# EAGLE board EEZ PSU Arduino shield+BP r3B4 (EAGLE 6.1), part 1 of 2
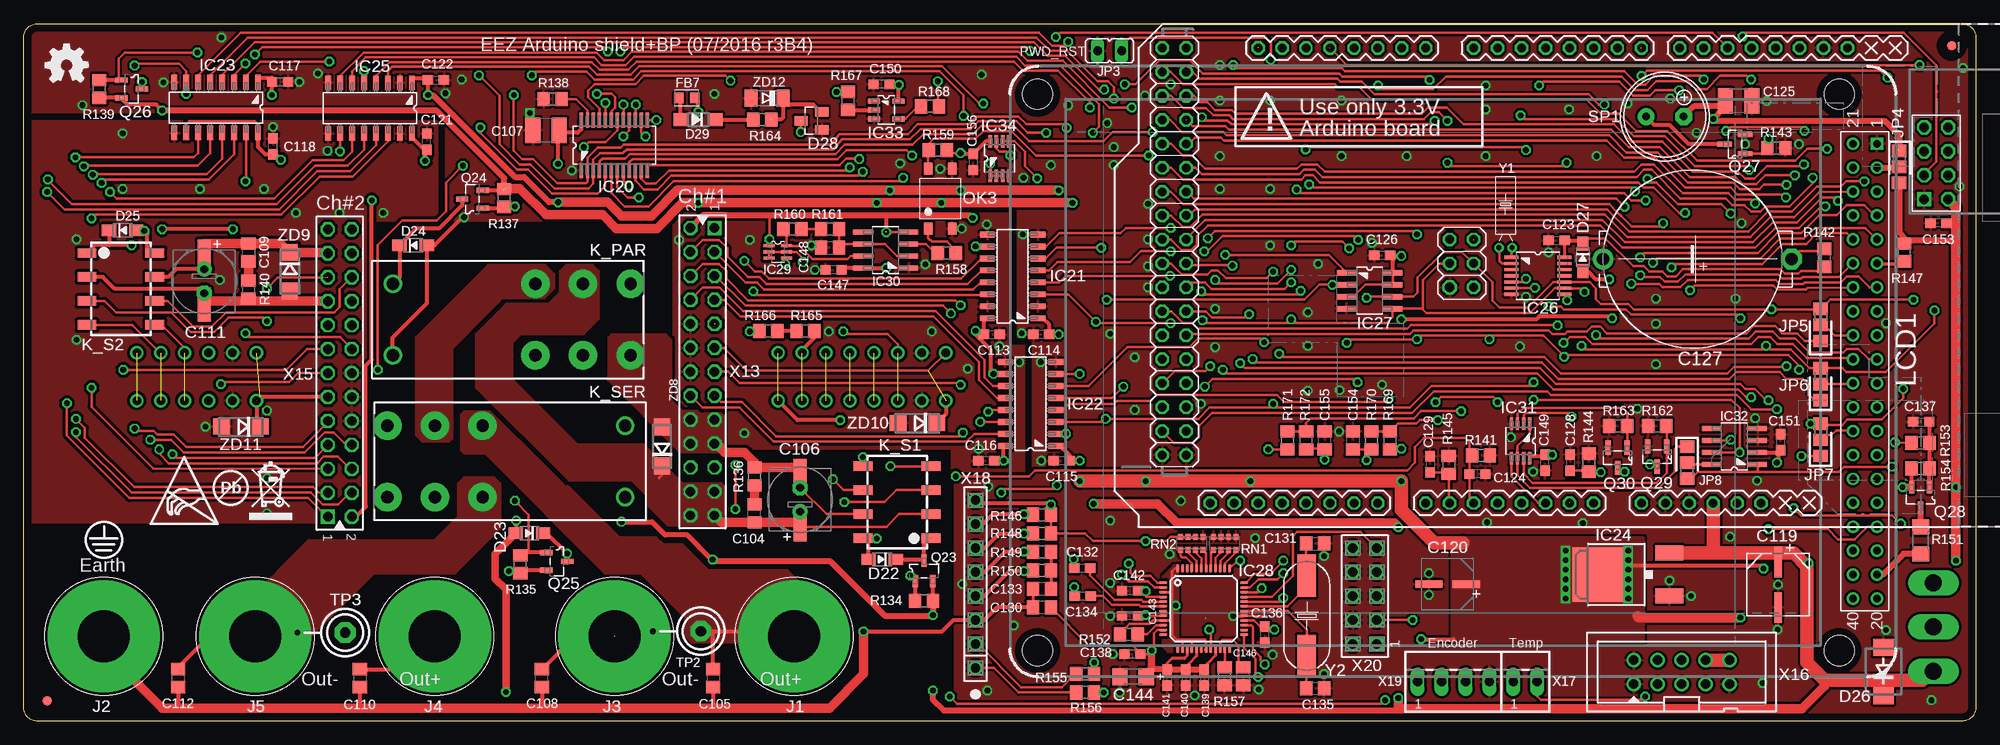
[diagram p5: board, top side]
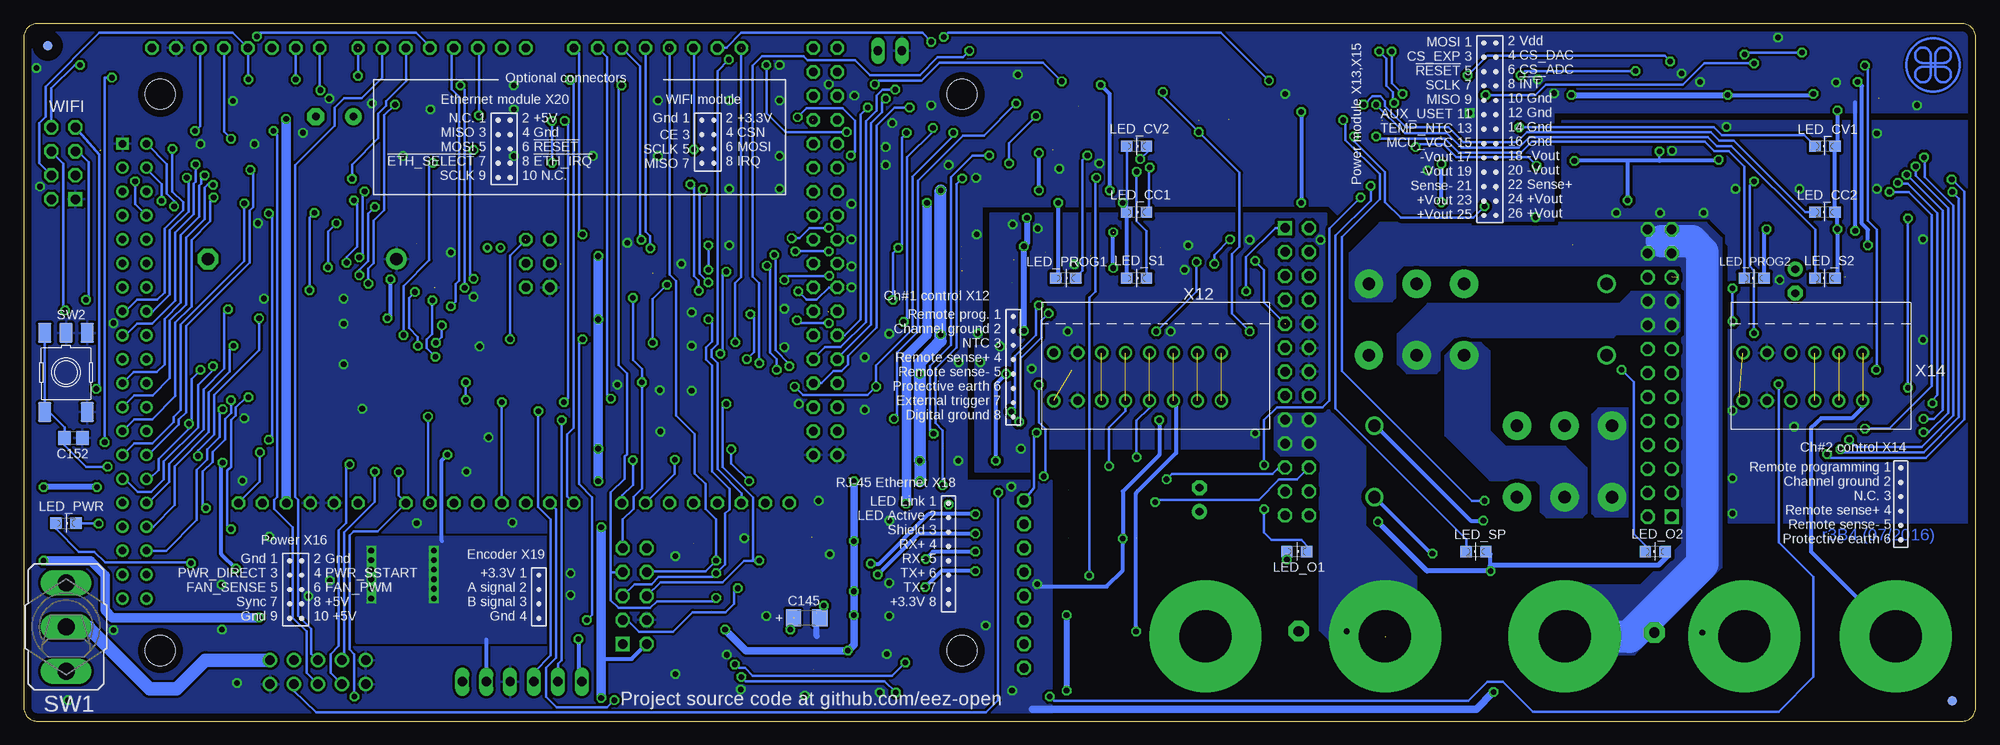
[diagram p6: board, bottom side, seen from below]

Size 207 x 74 mm. Coordinates in mm from the lower left corner, seen from the top.
Outline: 1.5,74 205.5,74 arc-90 207,72.5 207,1.5 arc-90 205.5,0 1.5,0 arc-90 0,1.5 0,72.5 arc-90 1.5,74
Copper layers (1+5*16): Top 0.035mm / dielectric 0.75mm / Route5 0.035mm / dielectric 0.75mm / Bottom 0.035mm
Design rules: minimum track width 10mil, minimum drill 0.5mm, track to track 8mil, track to pad 8mil, pad to pad 8mil, via to via 8mil, smd to smd 8mil, copper to edge 30mil, drill to drill 8mil, minimum pad ring 10mil, minimum via ring 8mil, stop-mask expansion 4mil, vias tented up to drill 25mil, thermal gap 10mil
Net classes: 0 default: width 0.254 mm, drill 0.584 mm, clearance 0.254 mm; 1 dgnd: width 0.254 mm, drill 0.584 mm, clearance 0.254 mm; 2 gnd: width 0.254 mm, drill 0.584 mm, clearance 0.254 mm

## Footprints (pad centres in the part's own frame; a part is rotated, then mirrored left to right if it is on the bottom)
C0805 = smd 1.3 x 1.5: 1 -0.95,0; 2 0.95,0
CAPAE660X610N_COMBO2 = smd 3.6 x 1.4: 1 -2.6,0; 2 2.5,0 | drill 0.813 pad 1.6: 1.1 -1.27,0 | drill 0.813 pad 1.6 octagon: 2.1 1.27,0
C1210 = smd 1.6 x 2.7: 1 -1.4,0; 2 1.4,0
C0603 = smd 1.1 x 1: 1 -0.85,0; 2 0.85,0
CAPAE660X610N = smd 3.251 x 0.762: 1 -2.413,0; 2 2.413,0
PANASONIC_C = smd 2.87 x 0.762: 1 -1.981,0; 2 1.981,0
SG-R20MM = drill 1.3 pad 2.184 octagon: 1 10.389,0 | drill 1.3 pad 2.184: 2 -9.601,0
EC1206 = smd 1.6 x 1.8: + -1.4,0; - 1.4,0
SOD323-W = smd 1.5 x 1.2: A 1.45,0; C -1.45,0
DO214AA = smd 1.8 x 2.2: A 2.55,0; C -2.55,0
SOT23 = smd 1 x 1.4: 1 -0.95,-1.1; 2 0.95,-1.1; 3 0,1.1
SOD123 = smd 1.4 x 1.4: A 1.9,0; C -1.9,0
BEAD0603 = smd 1 x 1.1: P$1 -0.85,0; P$2 0.85,0
FIDUCIAL_DUAL = smd 1.016 x 1.016 bottom: B 0,0 | smd 1.016 x 1.016: T 0,0
SOP63P600X175-24N = smd 1.6 x 0.356: 1 -2.667,3.505; 2 -2.667,2.845; 3 -2.667,2.235; 4 -2.667,1.575; 5 -2.667,0.965; 6 -2.667,0.305; 7 -2.667,-0.305; 8 -2.667,-0.965; 9 -2.667,-1.575; 10 -2.667,-2.235; 11 -2.667,-2.845; 12 -2.667,-3.505; 13 2.667,-3.505; 14 2.667,-2.845; 15 2.667,-2.235; 16 2.667,-1.575; 17 2.667,-0.965; 18 2.667,-0.305; 19 2.667,0.305; 20 2.667,0.965; 21 2.667,1.575; 22 2.667,2.235; 23 2.667,2.845; 24 2.667,3.505
SOIC-16 = smd 1.549 x 0.61: 1 -2.692,4.445; 2 -2.692,3.175; 3 -2.692,1.905; 4 -2.692,0.635; 5 -2.692,-0.635; 6 -2.692,-1.905; 7 -2.692,-3.175; 8 -2.692,-4.445; 9 2.692,-4.445; 10 2.692,-3.175; 11 2.692,-1.905; 12 2.692,-0.635; 13 2.692,0.635; 14 2.692,1.905; 15 2.692,3.175; 16 2.692,4.445
DPACK = smd 1.6 x 3: 1 -2.28,-4.8; 3 2.28,-4.8 | smd 5.8 x 6.2: 4 0,2.38
SOP65P640X120-14N = smd 1.473 x 0.356: 1 -2.819,1.956; 2 -2.819,1.295; 3 -2.819,0.66; 4 -2.819,0; 5 -2.819,-0.66; 6 -2.819,-1.295; 7 -2.819,-1.956; 8 2.819,-1.956; 9 2.819,-1.295; 10 2.819,-0.66; 11 2.819,0; 12 2.819,0.66; 13 2.819,1.295; 14 2.819,1.956
SOIC127P600X175-8N = smd 1.981 x 0.559: 1 -2.464,1.905; 2 -2.464,0.635; 3 -2.464,-0.635; 4 -2.464,-1.905; 5 2.464,-1.905; 6 2.464,-0.635; 7 2.464,0.635; 8 2.464,1.905
TQFP48-7X7 = smd 0.85 x 0.32: 1 -4.275,2.75; 2 -4.275,2.25; 3 -4.275,1.75; 4 -4.275,1.25; 5 -4.275,0.75; 6 -4.275,0.25; 7 -4.275,-0.25; 8 -4.275,-0.75; 9 -4.275,-1.25; 10 -4.275,-1.75; 11 -4.275,-2.25; 12 -4.275,-2.75; 25 4.275,-2.75; 26 4.275,-2.25; 27 4.275,-1.75; 28 4.275,-1.25; 29 4.275,-0.75; 30 4.275,-0.25; 31 4.275,0.25; 32 4.275,0.75; 33 4.275,1.25; 34 4.275,1.75; 35 4.275,2.25; 36 4.275,2.75 | smd 0.32 x 0.85: 13 -2.75,-4.275; 14 -2.25,-4.275; 15 -1.75,-4.275; 16 -1.25,-4.275; 17 -0.75,-4.275; 18 -0.25,-4.275; 19 0.25,-4.275; 20 0.75,-4.275; 21 1.25,-4.275; 22 1.75,-4.275; 23 2.25,-4.275; 24 2.75,-4.275; 37 2.75,4.275; 38 2.25,4.275; 39 1.75,4.275; 40 1.25,4.275; 41 0.75,4.275; 42 0.25,4.275; 43 -0.25,4.275; 44 -0.75,4.275; 45 -1.25,4.275; 46 -1.75,4.275; 47 -2.25,4.275; 48 -2.75,4.275
SOT65P210X110-6N = smd 1.168 x 0.356: 1 -0.94,0.66; 2 -0.94,0; 3 -0.94,-0.66; 4 0.94,-0.66; 5 0.94,0; 6 0.94,0.66
SOP65P400X130-8N = smd 1.321 x 0.356: 1 -1.829,0.965; 2 -1.829,0.33; 3 -1.829,-0.33; 4 -1.829,-0.965; 5 1.829,-0.965; 6 1.829,-0.33; 7 1.829,0.33; 8 1.829,0.965
SOT95P280X145-5N = smd 1.27 x 0.559: 1 -1.295,0.94; 2 -1.295,0; 3 -1.295,-0.94; 4 1.295,-0.94; 5 1.295,0.94
BP_5_12 = drill 5.5 pad 11.9: P$1 0,0
JP1 = drill 0.914 long: 1 0,-1.27; 2 0,1.27
A0R-JMP = smd 1.5 x 1.3: 1 0,1.7; 2 0,0; 3 0,-1.7
RT-C/016A5_ROUND = drill 1.3 pad 3: 11A 8.83,3.78; 11B 8.83,-3.78; 12A 3.79,3.78; 12B 3.79,-3.78; 14A 13.87,3.78; 14B 13.87,-3.78 | drill 1.3: A1 -11.33,-3.78; A2 -11.33,3.78
G6K-2F = smd 1 x 2: 1 -3.81,-3.6; 2 -1.27,-3.6; 3 1.27,-3.6; 4 3.81,-3.6; 5 3.81,3.6; 6 1.27,3.6; 7 -1.27,3.6; 8 -3.81,3.6
LCD_TFT_320QVT_MIRROR = drill 0.8 square: 1 48.26,0 | drill 0.8: 2 45.72,0; 3 43.18,0; 4 40.64,0; 5 38.1,0; 6 35.56,0; 7 33.02,0; 8 30.48,0; 9 27.94,0; 10 25.4,0; 11 22.86,0; 12 20.32,0; 13 17.78,0; 14 15.24,0; 15 12.7,0; 16 10.16,0; 17 7.62,0; 18 5.08,0; 19 2.54,0; 20 0,0; 21 48.26,2.54; 22 45.72,2.54; 23 43.18,2.54; 24 40.64,2.54; 25 38.1,2.54; 26 35.56,2.54; 27 33.02,2.54; 28 30.48,2.54; 29 27.94,2.54; 30 25.4,2.54; 31 22.86,2.54; 32 20.32,2.54; 33 17.78,2.54; 34 15.24,2.54; 35 12.7,2.54; 36 10.16,2.54; 37 7.62,2.54; 38 5.08,2.54; 39 2.54,2.54; 40 0,2.54 | hole 3.2: -5.5,4; 53.5,4; -5.5,89; 53.5,89
LED_0805 = smd 1.2 x 1.2: A 0,-1.05; C 0,1.05
ARDUINO+ICSP_MIRROR = drill 0.9 octagon: 0 63.5,2.54; 1 60.96,2.54; 2 58.42,2.54; 3 55.88,2.54; 3.3V 35.56,50.8; 4 53.34,2.54; 5 50.8,2.54; 5V 38.1,50.8; 5V(1) 93.98,2.54; 5V(2) 96.52,2.54; 6 48.26,2.54; 7 45.72,2.54; 8 41.656,2.54; 9 39.116,2.54; 10 36.576,2.54; 11 34.036,2.54; 12 31.496,2.54; 13 28.956,2.54; 14 68.58,2.54; 15 71.12,2.54; 16 73.66,2.54; 17 76.2,2.54; 18 78.74,2.54; 19 81.28,2.54; 20 83.82,2.54; 21 86.36,2.54; 22 93.98,5.08; 23 96.52,5.08; 24 93.98,7.62; 25 96.52,7.62; 26 93.98,10.16; 27 96.52,10.16; 28 93.98,12.7; 29 96.52,12.7; 30 93.98,15.24; 31 96.52,15.24; 32 93.98,17.78; 33 96.52,17.78; 34 93.98,20.32; 35 96.52,20.32; 36 93.98,22.86; 37 96.52,22.86; 38 93.98,25.4; 39 96.52,25.4; 40 93.98,27.94; 41 96.52,27.94; 42 93.98,30.48; 43 96.52,30.48; 44 93.98,33.02; 45 96.52,33.02; 46 93.98,35.56; 47 96.52,35.56; 48 93.98,38.1; 49 96.52,38.1; 50 93.98,40.64; 51 96.52,40.64; 52 93.98,43.18; 53 96.52,43.18; A0 50.8,50.8; A1 53.34,50.8; A2 55.88,50.8; A3 58.42,50.8; A4 60.96,50.8; A5 63.5,50.8; A6 66.04,50.8; A7 68.58,50.8; A8 73.66,50.8; A9 76.2,50.8; A10 78.74,50.8; A11 81.28,50.8; A12 83.82,50.8; A13 86.36,50.8; A14 88.9,50.8; A15 91.44,50.8; AREF 23.876,2.54; GND 26.416,2.54; GND1 40.64,50.8; GND2 43.18,50.8; GND3 93.98,45.72; GND4 96.52,45.72; ICSP_+5V 66.04,22.86; ICSP_MISO 63.5,22.86; ICSP_MOSI 66.04,25.4; ICSP_RESET 63.5,27.94; ICSP_SCK 63.5,25.4; RESET 33.02,50.8; VIN 45.72,50.8 | drill 1.016 octagon: ICSP_GND 66.04,27.94
HCPL-181 = smd 0.889 x 1.27: 1 -1.27,-3.175; 2 1.27,-3.175; 3 1.27,3.175; 4 -1.27,3.175
SOT95P237X112-3N = smd 1.321 x 0.559: 1 -1.092,0.94; 2 -1.092,-0.94; 3 1.092,0
SOT103P240X110-3N = smd 1.524 x 0.559: 1 -1.079,1.016; 2 -1.079,-1.016; 3 1.079,0
R0805 = smd 1.3 x 1.5: 1 -0.95,0; 2 0.95,0
R1206 = smd 1.6 x 1.803: 1 -1.422,0; 2 1.422,0
CAY16 = smd 0.5 x 0.65: 1 -1.2,-0.675; 2 -0.4,-0.675; 3 0.4,-0.675; 4 1.2,-0.675; 5 1.2,0.675; 6 0.4,0.675; 7 -0.4,0.675; 8 -1.2,0.675
SHORT_NOHOLE = smd 0.5 x 0.25 bottom: P$1 0,0.117; P$2 0,-0.117
LD-BZEN-0903 = drill 0.8 pad 1.778 octagon: +B 2,0 | drill 0.8 pad 1.778: -B -2,0
M9040P = drill 1.803 long: 1 0,4.699; 2 0,0; 3 0,-4.699
TACTM-6XN = smd 2.1 x 1.4: 1 -4.2,2.25; 2 4.2,2.25; 3 -4.2,-2.25; 4 4.2,-2.25; 5 -4.2,0
TP_1.1MM = drill 0.6 square: GND 5.08,0 | drill 1.1 pad 2.184 octagon: TIP 0,0
MOD-NRF24L01_MIRROR = drill 1 pad 1.5 square: 1 0,0 | drill 1 pad 1.5 octagon: 2 2.54,0; 3 0,2.54; 4 2.54,2.54; 5 0,5.08; 6 2.54,5.08; 7 0,7.62; 8 2.54,7.62
MC000006_MIRROR = drill 0.9: 1 0,0; 1.1 0,-5.08; 2 -2.54,0; 2.1 -2.54,-5.08; 3 -5.08,0; 3.1 -5.08,-5.08; 4 -7.62,0; 4.1 -7.62,-5.08; 5 -10.16,0; 5.1 -10.16,-5.08; 6 -12.7,0; 6.1 -12.7,-5.08; 7 -15.24,0; 7.1 -15.24,-5.08; 8 -17.78,0; 8.1 -17.78,-5.08
TSW-113-07-F-D = drill 1 pad 1.5 square: 1 30.48,0 | drill 1 pad 1.5 octagon: 2 30.48,2.54; 3 27.94,0; 4 27.94,2.54; 5 25.4,0; 6 25.4,2.54; 7 22.86,0; 8 22.86,2.54; 9 20.32,0; 10 20.32,2.54; 11 17.78,0; 12 17.78,2.54; 13 15.24,0; 14 15.24,2.54; 15 12.7,0; 16 12.7,2.54; 17 10.16,0; 18 10.16,2.54; 19 7.62,0; 20 7.62,2.54; 21 5.08,0; 22 5.08,2.54; 23 2.54,0; 24 2.54,2.54; 25 0,0; 26 0,2.54
MC000005_MIRROR = drill 0.9: 1 0,0; 1.1 0,-5.08; 2 -2.54,0; 2.1 -2.54,-5.08; 3 -5.08,0; 3.1 -5.08,-5.08; 4 -7.62,0; 4.1 -7.62,-5.08; 5 -10.16,0; 5.1 -10.16,-5.08; 6 -12.7,0; 6.1 -12.7,-5.08
IDC-10PIN = drill 1 pad 1.422: 1 -5.08,-1.27; 2 -5.08,1.27; 3 -2.54,-1.27; 4 -2.54,1.27; 5 0,-1.27; 6 0,1.27; 7 2.54,-1.27; 8 2.54,1.27; 9 5.08,-1.27; 10 5.08,1.27
22-23-2021 = drill 1 long: 1 -1.27,0; 2 1.27,0
SSW-108-02-S-S = drill 1 pad 1.5 octagon: 1 -8.89,0; 2 -6.35,0; 3 -3.81,0; 4 -1.27,0; 5 1.27,0; 6 3.81,0; 7 6.35,0; 8 8.89,0
22-23-2041 = drill 1 long: 1 -3.81,0; 2 -1.27,0; 3 1.27,0; 4 3.81,0
SSW-105-02-S-D = drill 1 pad 1.5 square: 1 -5.08,-1.27 | drill 1 pad 1.5 octagon: 2 -5.08,1.27; 3 -2.54,-1.27; 4 -2.54,1.27; 5 0,-1.27; 6 0,1.27; 7 2.54,-1.27; 8 2.54,1.27; 9 5.08,-1.27; 10 5.08,1.27
R26_XTAL = drill 0.5: 1 -0.7,0; 2 0.7,0
HC-49/4H = smd 4.5 x 2: 1 -4.25,0; 2 4.25,0
DO214AC = smd 1.8 x 1.7: A 2.05,0; C -2.05,0
MINIMELF = smd 1.4 x 1.8: A 1.7,0; C -1.7,0

## Placement (x,y rotation side)
C104  470n  [C0805]  77.5,22.03 90 top
C105  10n  [C0805]  73.12,4.57 270 top
C106  UPW1J150MED  [CAPAE660X610N_COMBO2]  82.33,23.5 90 top
C107  10u  [C1210]  55.4,62.67 180 top
C108  10n  [C0805]  54.96,4.57 90 top
C109  470n  [C0805]  23.84,49.72 270 top
C110  10n  [C0805]  35.65,4.57 270 top
C111  UPW1J150MED  [CAPAE660X610N_COMBO2]  19.14,46.67 270 top
C112  10n  [C0805]  16.41,4.57 90 top
C113  100n  [C0603]  102.65,41.02 0 top
C114  100n  [C0603]  107.92,41.02 180 top
C115  100n  [C0603]  110.07,27.62 180 top
C116  100n  [C0603]  102.07,27.62 180 top
C117  100n  [C0603]  27.21,67.82 0 top
C118  100n  [C0603]  26.45,60.96 90 top
C119  47u  [CAPAE660X610N]  186.02,14.48 270 top
C120  10u  [PANASONIC_C]  150.97,14.54 180 top
C121  100n  [C0603]  42.76,61.47 90 top
C122  100n  [C0603]  43.72,68.01 0 top
C123  100n  [C0603]  162.53,50.99 0 top
C124  100n  [C0603]  154.14,26.23 180 top
C125  10u  [C1210]  181.83,65.79 180 top
C126  100n  [C0603]  144.05,49.4 180 top
C127  EECS5R5H105  [SG-R20MM]  177.07,49.02 0 top
C128  100n  [C0603]  163.99,27.43 270 top
C129  100n  [C0603]  149.13,27.24 270 top
C130  22n  [C0805]  107.98,12.06 180 top
C131  18p  [C0805]  136.94,18.86 0 top
C132  6n8  [C0603]  112.23,16.26 0 top
C133  10n  [C0805]  107.98,14.03 180 top
C134  6n8  [C0603]  112.3,13.27 0 top
C135  18p  [C0805]  136.94,3.49 0 top
C136  100n  [C0603]  131.6,9.21 90 top
C137  100n  [C0603]  201.2,31.75 0 top
C138  100n  [C0603]  117.57,7.11 180 top
C139  100n  [C0603]  125.19,4.64 270 top
C140  100n  [C0603]  123.22,4.64 270 top
C141  100n  [C0603]  121.25,4.64 270 top
C142  100n  [C0603]  117.31,13.84 180 top
C143  100n  [C0603]  117.31,11.18 180 top
C144  10u  [EC1206]  117.63,4.7 180 top
C145  4u7  [EC1206]  123.98,10.99 0 bottom
C146  10n  [C0805]  129.32,4.76 90 top
C147  100n  [C0603]  85.88,47.88 180 top
C148  47n  [C0805]  85.5,50.23 0 top
C149  100n  [C0603]  161.32,27.43 90 top
C150  100n  [C0603]  90.96,67.56 180 top
C151  100n  [C0603]  186.27,29.59 270 top
C152  47n  [C0805]  201.71,30.04 180 bottom
C153  100n  [C0603]  203.04,52.83 180 top
C154  10n  [C0805]  140.94,29.78 270 top
C155  10n  [C0805]  137.95,29.78 90 top
C156  100n  [C0603]  100.68,59.31 270 top
D22  BAS316  [SOD323-W]  91.03,17.17 180 top
D23  BAS316  [SOD323-W]  53.62,19.94 180 top
D24  BAS316  [SOD323-W]  41.3,50.48 0 top
D25  BAS316  [SOD323-W]  10.51,52.07 0 top
D26  SMBJ5.0A-TR  [DO214AA]  197.2,5.27 90 top
D27  BAS316  [SOD323-W]  165.32,49.21 270 top
D28  BAT54S  [SOT23]  83.53,63.69 90 top
D29  SKL16  [SOD123]  71.53,63.82 180 top
EEZ_SIGNATURE2  SIGNATURESMALL  [SIGNATURE_5MM]  4.55,69.61 180 top
FB7  60R@100MHz  [BEAD0603]  70.32,66.1 180 top
FM5  FIDUCIAL_2  [FIDUCIAL_DUAL]  204.44,71.63 0 top
FM6  FIDUCIAL_2  [FIDUCIAL_DUAL]  2.51,2.16 0 top
IC20  TLC5925IDBQR  [SOP63P600X175-24N]  62.64,61.09 90 top
IC21  Si8641EC-B-IS1  [SOIC-16]  104.87,47.18 180 top
IC22  SI8651EC-B-IS1  [SOIC-16]  106.77,33.66 180 top
IC23  SI8651EC-B-IS1  [SOIC-16]  20.41,65.09 270 top
IC24  LD1117ADT33TR  [DPACK]  169.7,15.56 90 top
IC25  Si8641EC-B-IS1  [SOIC-16]  36.73,65.02 270 top
IC26  PCA21125T/Q900/1,1  [SOP65P640X120-14N]  160.56,47.24 0 top
IC27  AT25256B-SSHL-B  [SOIC127P600X175-8N]  142.71,45.66 0 top
IC28  W5500  [TQFP48-7X7]  125.12,11.94 0 top
IC29  BC857BS  [SOT65P210X110-6N]  79.98,49.78 0 top
IC30  TLC555  [SOIC127P600X175-8N]  91.41,49.97 180 top
IC31  SN74LVC2G08DCTR  [SOP65P400X130-8N]  158.72,29.72 270 top
IC32  TPS3705-33D  [SOIC127P600X175-8N]  181.39,29.15 180 top
IC33  SN74LV1T34DBVR  [SOT95P280X145-5N]  91.47,64.83 0 top
IC34  SN74LVC2G02DCTR  [SOP65P400X130-8N]  103.47,59.69 90 top
J1  BS-244DSM-R  [BP_5_12]  81.7,9 0 top
J2  BS-244DSM-G  [BP_5_12]  8.5,9 0 top
J3  BS-244DSM-B  [BP_5_12]  62.65,9 0 top
J4  BS-244DSM-R  [BP_5_12]  43.6,9 0 top
J5  BS-244DSM-B  [BP_5_12]  24.55,9 0 top
JP3  826926-2  [JP1]  115.16,71.12 90 top
JP4  0R-JUMPA  [A0R-JMP]  198.85,58.8 0 top
JP5  0R-JUMPA  [A0R-JMP]  190.53,42.04 0 top
JP6  0R-JUMPA  [A0R-JMP]  190.53,35.75 0 top
JP7  0R-JUMPA  [A0R-JMP]  190.53,29.84 0 top
JP8  0R-JUMPA  [A0R-JMP]  176.37,27.43 180 top
K_PAR  RT424005  [RT-C/016A5_ROUND]  50.48,42.61 0 top
K_S1  G6K-2F-5DC  [G6K-2F]  92.61,23.24 90 top
K_S2  G6K-2F-5DC  [G6K-2F]  10.32,45.85 270 top
K_SER  RT424005  [RT-C/016A5_ROUND]  52.45,27.56 180 top
LCD1  TFT_320QVT  [LCD_TFT_320QVT_MIRROR]  196.5,13 90 top
LED_CC1  HSMH-C170  [LED_0805]  89,54 270 bottom
LED_CC2  HSMH-C170  [LED_0805]  16,54 90 bottom
LED_CV1  HSMY-C170  [LED_0805]  16,61 90 bottom
LED_CV2  HSMY-C170  [LED_0805]  89,61 270 bottom
LED_O1  HSMG-C170  [LED_0805]  72,18 270 bottom
LED_O2  HSMG-C170  [LED_0805]  34,18 90 bottom
LED_PROG1  HSMH-C170  [LED_0805]  96.5,47 270 bottom
LED_PROG2  HSMH-C170  [LED_0805]  23.5,47 90 bottom
LED_PWR  HSMD-C170  [LED_0805]  202.5,21 270 bottom
LED_S1  HSMY-C170  [LED_0805]  89,47 270 bottom
LED_S2  HSMY-C170  [LED_0805]  16,47 90 bottom
LED_SP  HSMH-C170  [LED_0805]  53,18 90 bottom
MCU  Arduino Due  [ARDUINO+ICSP_MIRROR]  217.25,73.95 180 top
OK3  HCPL-181  [HCPL-181]  97.18,55.44 0 top
Q23  IRLML2246TRPBF  [SOT95P237X112-3N]  95.47,15.94 90 top
Q24  IRLML2246TRPBF  [SOT95P237X112-3N]  47.59,55.37 180 top
Q25  IRLML2246TRPBF  [SOT95P237X112-3N]  56.54,16.95 0 top
Q26  IRLML2246TRPBF  [SOT95P237X112-3N]  11.46,67.06 0 top
Q27  2N7002  [SOT103P240X110-3N]  181.45,61.21 180 top
Q28  IRLML2246TRPBF  [SOT95P237X112-3N]  201.13,23.75 270 top
Q29  2N7002  [SOT103P240X110-3N]  173.19,28.07 270 top
Q30  2N7002  [SOT103P240X110-3N]  169,27.94 270 top
R134  4K7  [R0805]  95.47,12.76 0 top
R135  4K7  [R0805]  52.67,16.65 270 top
R136  1R  [R0805]  77.5,25.97 270 top
R137  4K7  [R0805]  50.96,55.5 90 top
R138  1K8  [R0805]  56.1,65.98 0 top
R139  4K7  [R0805]  8.03,67.06 270 top
R140  1R  [R0805]  23.84,45.78 90 top
R141  4K7  [R0805]  154.52,28.19 0 top
R142  180R  [R0805]  190.91,49.15 270 top
R143  100K  [R0805]  185.83,60.77 180 top
R144  4K7  [R0805]  165.95,27.43 90 top
R145  4K7  [R0805]  151.1,27.18 90 top
R146  49R9  [R0805]  107.98,21.91 180 top
R147  10K  [R0805]  199.42,49.72 90 top
R148  49R9  [R0805]  107.98,19.94 0 top
R149  49R9  [R0805]  107.98,17.97 180 top
R150  49R9  [R0805]  107.98,16 0 top
R151  10R  [R1206]  201.13,19.18 270 top
R152  12K4  [R0805]  117.19,9.21 0 top
R153  10K  [R0805]  201.13,29.53 0 top
R154  100K  [R0805]  201.13,26.8 180 top
R155  180R  [R0805]  112.55,5.02 180 top
R156  180R  [R0805]  112.55,3.05 180 top
R157  10K  [R0805]  127.35,4.76 90 top
R158  180R  [R0805]  97.88,49.66 0 top
R159  1K8  [R0805]  96.93,60.58 180 top
R160  750R  [R0805]  81.5,52.2 0 top
R161  750R  [R0805]  85.5,52.2 0 top
R162  47K  [R0805]  173.19,31.31 180 top
R163  47K  [R0805]  169.07,31.31 180 top
R164  100R  [R0805]  78.32,63.82 180 top
R165  5K1  [R0805]  82.9,41.4 0 top
R166  5K1  [R0805]  78.96,41.4 0 top
R167  1K  [R0805]  87.41,65.79 90 top
R168  1K  [R0805]  96.1,65.21 180 top
R169  4K7  [R0805]  144.87,29.78 90 top
R170  10K  [R0805]  142.9,29.78 90 top
R171  4K7  [R0805]  134.01,29.78 90 top
R172  10K  [R0805]  135.98,29.78 90 top
RN1  4x10K  [CAY16]  127.35,18.86 0 top
RN2  4x10K  [CAY16]  123.85,18.86 0 top
SH3  [SHORT_NOHOLE]  122.9,10.35 180 top
SP1  LD-BZEN-0903  [LD-BZEN-0903]  174.02,64.14 0 top
SW1  A101SYCQ04  [M9040P]  202.5,10 0 bottom
SW2  1301.9316  [TACTM-6XN]  202.5,37 270 bottom
TP2  [TP_1.1MM]  71.8,9.54 180 top
TP3  [TP_1.1MM]  34.1,9.4 180 top
U$7  [ESD_SYMBOL]  13.46,20.93 0 top
U$8  [RECYCLE_BIN1/8]  23.91,21.34 0 top
U$9  [PB_SMALL]  21.94,24.77 0 top
WIFI  NRF24L01 module  [MOD-NRF24L01_MIRROR]  201.51,55.37 0 top
X12  MC000006  [MC000006_MIRROR]  80,34 180 top
X13  TSW-113-07-F-D  [TSW-113-07-F-D]  73.25,21.83 90 top
X14  MC000005  [MC000005_MIRROR]  12,34 180 top
X15  TSW-113-07-F-D  [TSW-113-07-F-D]  32.25,52.17 270 top
X16  09185067324  [IDC-10PIN]  175.8,5.21 0 top
X17  22-23-2021  [22-23-2021]  159.22,4.19 0 top
X18  MC34753  [SSW-108-02-S-S]  100.93,14.54 90 top
X19  22-23-2041  [22-23-2041]  151.6,4.19 0 top
X20  SSW-105-02-S-D  [SSW-105-02-S-D]  142.21,13.27 90 top
Y1  32,768kHz  [R26_XTAL]  157.13,50.23 0 top
Y2  25MHz  [HC-49/4H]  136.05,11.18 270 top
ZD8  P4SMAJ60A  [DO214AC]  67.72,29.15 90 top
ZD9  P4SMAJ60A  [DO214AC]  28.22,47.67 270 top
ZD10  SMAJ18A  [DO214AC]  94.77,31.62 180 top
ZD11  SMAJ18A  [DO214AC]  23.03,31.24 180 top
ZD12  4V3  [MINIMELF]  78.83,66.1 180 top

## Tracks (layer width: path | path; a pad name or v marks a point on that pad's centre or on a via)
1V2O
  Top 0.254: IC28.22 126.88,8.42 127.09,8.64 128.24,8.64 128.81,8.06 128.81,6.16 129.25,5.71 C146.2
!ADC1_SELECT  (via drill 0.6)
  Top 0.254: v144.75,34.23 144.37,33.85 133.63,33.85 132.87,34.61 120.11,34.61 119.47,33.97 115.92,33.97 115.6,33.66 110.84,33.66 110.2,33.02 IC22.4
  Bottom 0.254: v144.75,34.23 145.13,34.61 145.13,70.41 MCU.15
!ADC2_SELECT  (via drill 0.6)
  Top 0.254: v113.06,65.09 113.06,65.66 109.69,69.03 105.95,69.03 105,69.98 64.99,69.98 64.1,69.09 61.05,69.09 60.23,69.91 38.83,69.91 37.37,68.45 IC25.4
  Bottom 0.254: MCU.48 123.25,35.88 122.39,35.88 121.12,37.15 120.3,37.15 119.6,37.85 119.6,38.73 116.55,41.78 116.55,63.18 114.65,65.09 v113.06,65.09
!BP_OE  (via drill 0.6)
  Top 0.254: v109.44,72.58 109.88,73.01 179.08,73.01 MCU.10 | IC20.21 61.07,64.95 59.85,66.17 59.85,66.86 60.54,67.56 64.86,67.56 65.75,68.45 74.45,68.45 v74.96,67.94
  Bottom 0.254: v109.44,72.58 109,73.03 80.04,73.03 v74.96,67.94
!BP_OUT0  (via drill 0.6)
  Top 0.254: IC20.5 61.68,56.76 60.86,55.94 56.04,55.94 53.5,58.48 52.35,58.48 48.42,62.42 v48.42,62.99
  Bottom 0.254: LED_CV1.C 18.22,62.17 26.95,62.17 27.78,62.99 v48.42,62.99
!BP_OUT1  (via drill 0.6)
  Top 0.254: IC20.6 62.34,56.02 63.75,54.61 66.26,54.61 68.93,57.28 92.87,57.28 v93.25,57.66 | Q23.1 94.53,15.16 94.26,15.43 v94.01,15.43
  Top 0.406: Q23.1 94.53,12.77 R134.1
  Bottom 0.254: v94.01,15.43 94.01,44.96 93.38,45.59 93.38,57.53 v93.25,57.66
!BP_OUT2  (via drill 0.6)
  Top 0.254: IC20.7 62.94,56.66 64.04,55.56 v65.24,55.56 | v75.47,22.48 v75.47,27.18
  Bottom 0.254: LED_O1.C 70.7,18.41 71.53,19.24 74.71,19.24 75.47,20 v75.47,22.48 | v75.47,27.18 75.47,31.94 74.13,33.27 69.31,33.27 68.55,34.04 68.55,52.26 v65.24,55.56
!BP_OUT3  (via drill 0.6)
  Top 0.254: IC20.8 63.61,57.33 v64.16,56.77
  Bottom 0.254: v64.16,56.77 64.16,55.24 67.91,51.5 67.91,33.15 54.05,19.29 LED_SP.C
!BP_OUT4  (via drill 0.6)
  Top 0.254: IC20.9 64.22,59.3 64.55,59.63 86.33,59.63 87.28,60.58 93.63,60.58 v94.2,60.01
  Bottom 0.254: 95.13,46.95 LED_PROG1.C 95.45,47.07 94.71,47.82 94.71,59.5 v94.2,60.01 94.33,59.88
!BP_OUT5  (via drill 0.6)
  Top 0.254: IC20.10 64.88,57.33 65.81,56.39 67.21,56.39 68.67,57.85 88.55,57.85 v88.99,58.29
  Bottom 0.254: LED_S1.C 87.95,51.98 88.99,53.02 v88.99,58.29
!BP_OUT6  (via drill 0.6)
  Top 0.254: IC20.11 65.49,57.54 66.01,57.02 67.02,57.02 68.42,58.42 87.28,58.42 v87.6,58.74
  Bottom 0.254: LED_CC1.C 87.7,54.06 87.66,54.1 87.66,58.67 v87.6,58.74
!BP_OUT7  (via drill 0.6)
  Top 0.254: IC20.12 66.15,58.94 66.2,58.99 86.52,58.99 87.22,59.69 88.55,59.69 v88.61,59.63
  Bottom 0.254: LED_CV2.C 87.7,60.54 v88.61,59.63
!BP_OUT8  (via drill 0.6)
  Top 0.254: 52.96,17.89 53.48,17.89 53.56,17.97 53.56,21.91 v52.1,23.37 | IC20.13 v67.09,63.75
  Top 0.406: Q25.1 52.96,17.89 R135.1
  Bottom 0.254: v52.1,23.37 53.43,23.37 67.21,37.15 67.21,51.37 63.21,55.37 63.21,58.04 66.83,61.66 66.83,63.5 v67.09,63.75
!BP_OUT9  (via drill 0.6)
  Top 0.254: R137.1 52.04,54.55 v52.1,54.61 | IC20.14 65.49,62.5 v65.94,62.04
  Top 0.406: Q24.1 50.84,54.43 R137.1
  Bottom 0.254: v52.1,54.61 53.31,53.4 60.99,53.4 62.64,55.05 62.64,58.23 65.94,61.53 v65.94,62.04
!BP_OUT10  (via drill 0.6)
  Top 0.254: IC20.15 64.88,65.35 v64.93,65.41
  Bottom 0.254: v64.93,65.41 64.86,65.41 63.97,66.29 63.15,66.29 62.64,65.79 62.64,65.22 60.42,62.99 55.91,62.99 54.32,61.4 48.67,61.4 47.59,62.48 28.1,62.48 27.21,61.59 25.68,61.59 18.09,54 LED_CC2.C 17.1,53.95
!BP_OUT12  (via drill 0.6)
  Top 0.254: IC20.17 63.61,65.39 v63.59,65.41
  Bottom 0.254: v63.59,65.41 60.54,62.36 56.1,62.36 54.58,60.83 48.48,60.83 47.34,61.98 28.41,61.98 27.46,61.02 25.94,61.02 17.05,52.14 LED_S2.C
!BP_OUT13  (via drill 0.6)  (1 unrouted)
  Top 0.254: v37.56,37.27 37.56,50.48 40.16,53.09 43.78,53.09 44.8,54.1 44.8,57.15 v46.57,58.93 | IC20.18 62.96,62.67 61.69,61.4 59.91,61.4 v59.4,60.9
  Bottom 0.254: LED_O2.C 34.8,18.39 36.29,19.88 36.29,36.01 v37.56,37.27 | v46.57,58.93 47.46,59.82 55.08,59.82 56.48,61.21 59.08,61.21 v59.4,60.9
!BP_OUT14  (via drill 0.6)
  Top 0.254: 10.43,68 Q26.1 10.11,68 10.06,67.94 10.06,70.29 10.7,70.93 v18.44,70.93 | v61.94,71.06 61.5,71.5 25.3,71.5 v24.54,70.74 | IC20.19 62.34,64.72 62.7,65.09 62.7,66.17 62.32,66.55 v60.8,66.55
  Top 0.406: Q26.1 8.04,68 R139.1
  Bottom 0.254: v61.94,71.06 61.94,67.69 v60.8,66.55 | v18.44,70.93 24.35,70.93 v24.54,70.74
!BP_OUT15  (via drill 0.6)
  Top 0.254: v199.04,20.95 v199.04,20.96 198.15,21.84 188.43,21.84 v187.67,22.61 | v129,37.97 129.51,37.47 160.75,37.47 162.46,35.75 182.02,35.75 182.53,35.24 183.55,35.24 184.75,34.04 v185,34.04 | v63.28,71.06 63.66,71.5 106.33,71.5 v106.71,71.12 | v61.69,65.6 61.69,63.77 IC20.20
  Bottom 0.254: v187.67,22.61 187.67,22.67 187.99,22.99 187.99,26.48 186.97,27.5 186.97,28.57 185.64,29.91 185.64,32.07 185,32.7 v185,34.04 | v129,37.97 129,46.48 129.7,47.18 129.7,69.53 128.68,70.55 124.3,70.55 123.85,70.1 118.84,70.1 117.25,68.52 111.98,68.52 110.07,70.42 107.41,70.42 v106.71,71.12 | v61.69,65.6 61.69,65.66 61.81,65.79 61.81,66.74 62.51,67.44 62.51,70.29 v63.28,71.06 | LED_PWR.C 199.08,21 v199.04,20.95
!CH1_ADC  (via drill 0.6)  (1 unrouted)
  Top 0.254: IC22.13 102.52,33.02 v102.26,32.83 | 70.71,47.24 71.97,48.51 73.75,48.51 74.51,47.75 74.51,46.93 76.8,44.64 98.84,44.64 v99.34,44.13
  Bottom 0.254: v102.26,32.83 101.88,33.21 101.88,38.73 99.66,40.96 99.66,43.81 v99.34,44.13
!CH1_DAC  (1 unrouted)
  Top 0.254: IC21.12 101.57,47.82 100.11,46.35 78.77,46.35 78.01,47.12 76.8,47.12 74.64,49.28 74.64,50.16 73.75,51.05 71.97,51.05 70.71,49.78
!CH1_EXPANDER  (1 unrouted)
  Top 0.254: 102.2,46.55 101.44,46.55 100.68,45.78 78.52,45.78 77.75,46.55 76.55,46.55 73.32,49.77 X13.3
!CH1_INT
  Top 0.254: IC22.11 102.77,35.56 101.88,36.45 101.88,38.29 96.68,43.5 76.29,43.5 73.82,45.97 72,45.97 X13.8
!CH1_RESET  (via drill 0.6)
  Top 0.254: IC22.14 v101.44,31.75 | X13.5 73.39,47.23 76.55,44.07 97.5,44.07 v98.33,43.24
  Bottom 0.254: v101.44,31.75 101.31,31.88 101.31,38.48 99.09,40.7 99.09,42.48 v98.33,43.24
!CH2_ADC  (via drill 0.6)
  Top 0.254: X15.6 34.57,26.8 33.3,28.07 31.84,28.07 31.14,27.37 15.4,27.37 14.38,28.38 v14.38,28.83 | v2.51,56.13 4.35,54.29 27.08,54.29 31.14,58.36 34.64,58.36 37.37,61.09 IC25.13
  Bottom 0.254: v14.38,28.83 14.06,28.51 5.55,28.51 1.81,32.26 1.81,55.44 v2.51,56.13
!CH2_DAC  (via drill 0.6)
  Top 0.254: IC23.12 19.78,60.26 18.44,58.93 6.44,58.93 v6.38,58.86 | X15.4 34.64,24.26 33.37,22.99 31.72,22.99 30.45,24.26 11.46,24.26 5.55,30.16 v5.55,30.67
  Bottom 0.254: v5.55,30.67 4.98,30.67 2.95,32.7 2.95,54.42 6.38,57.85 v6.38,58.86
!CH2_EXPANDER  (via drill 0.6)
  Top 0.254: IC23.13 21.05,59.69 19.4,58.04 7.39,58.04 v7.33,57.98 | X15.3 31.27,24.26 30.7,24.83 11.71,24.83 6.51,30.04 6.51,31.11 v5.55,32.07
  Bottom 0.254: v5.55,32.07 4.47,32.07 3.52,33.02 3.52,54.17 v7.33,57.98
!CH2_INT  (via drill 0.6)
  Top 0.254: IC23.11 18.51,60.26 18.06,59.82 v5.49,59.82 | v13.43,29.84 15.65,29.84 16.98,28.51 29.81,28.51 31.91,30.61 32.86,30.61 34.12,29.34 X15.8
  Bottom 0.254: v13.43,29.84 12.67,29.08 5.75,29.08 2.38,32.45 2.38,54.67 5.43,57.72 5.43,59.75 v5.49,59.82
!CH2_RESET  (via drill 0.6)
  Top 0.254: X15.5 13.74,26.8 7.2,33.34 v7.2,35.37 | v7.2,53.34 7.59,53.72 27.33,53.72 31.4,57.78 34.89,57.78 38.64,61.53 IC25.14
  Bottom 0.254: v7.2,35.37 v7.2,53.34
!CONVEND1  (via drill 0.6)  (1 unrouted)
  Top 0.254: IC22.6 112.93,35.56 117.06,39.69 123.6,39.69 124.49,40.58 131.16,40.58 v131.54,40.2
  Bottom 0.254: v131.54,40.2 131.54,46.48 130.9,47.12 130.9,71.44
!CONVEND2  (via drill 0.6)
  Top 0.254: IC23.6 18.51,68.52 23.02,73.03 107.66,73.03 109.06,71.63 110.33,71.63 v110.77,72.07
  Bottom 0.254: MCU.20 133.41,71.44 132.49,71.44 130.9,73.01 111.71,73.01 v110.77,72.07
!DAC1_SELECT  (via drill 0.6)  (2 unrouted)
  Top 0.254: v121.63,49.85 118.46,49.85 117.31,48.7 109.63,48.7 108.74,47.82 107.47,47.82 | v141.51,51.05 141.13,51.44 127.09,51.44 125.51,49.85 v125.19,49.85
  Bottom 0.254: v121.63,49.85 v125.19,49.85 | 143.6,71.44 141.63,69.47 141.63,51.18 v141.51,51.05
!DAC2_SELECT  (via drill 0.6)
  Top 0.254: IC23.5 19.78,68.52 23.78,72.52 107.41,72.52 108.81,71.12 110.65,71.12 113.88,67.88 114.96,67.88 115.6,67.25 v115.6,66.04
  Bottom 0.254: MCU.47 120.73,38.49 117.12,42.1 117.12,63.44 115.98,64.58 115.98,65.66 v115.6,66.04
!EEPROM_SELECT  (via drill 0.6)  (1 unrouted)
  Top 0.254: MCU.49 120.78,35.85 122.08,37.15 125.31,37.15 v125.82,37.66 | v127.41,49.47 138.4,49.47 140.3,47.56
  Bottom 0.254: v127.41,49.47 127.28,49.34 127.28,39.37 125.82,37.91 v125.82,37.66
!ETH_IRQ  (via drill 0.6)  (1 unrouted)
  Top 0.254: v201.01,69.6 140.33,69.6 MCU.18 | IC28.36 129.59,14.69 130.52,15.62 132.17,15.62 v133.57,17.02
  Bottom 0.254: WIFI.8 204.06,67.12 201.58,69.6 v201.01,69.6 | X20.8 140.87,15.88 134.71,15.88 v133.57,17.02 133.57,21.4 134.71,22.54 134.71,25.15 135.86,26.29 135.86,30.48 137.82,32.45 137.82,46.67 138.52,47.37 138.52,71.37
!ETH_SELECT  (via drill 0.6)  (1 unrouted)
  Top 0.254: IC28.32 133.18,12.69 v133.57,13.08 | v143.6,67.44 143.98,67.06 149.44,67.06 150.78,68.39 169.45,68.39 170.91,66.93 172.18,66.93 173.13,67.88 176.5,67.88 177.32,67.06 178.46,67.06 179.86,68.45 182.72,68.45 v183.16,68.07
  Bottom 0.254: WIFI.4 205.32,59.18 205.32,63.44 204.63,64.14 204.63,67.31 198.98,73.01 184.82,73.01 MCU.11 | 144.75,15.81 144.75,12.83 143.92,12 140.56,12 139.86,12.7 133.95,12.7 v133.57,13.08 | X20.7 144.75,15.81 | 144.75,15.81 144.75,24.26 143.29,25.72 143.29,28.07 143.03,28.32 143.03,36.89 143.92,37.78 143.92,67.12 v143.6,67.44 | v183.16,68.07 183.16,71.37 183.23,71.44
!IO_EXPANDER1  (via drill 0.6)
  Top 0.254: v121.57,47.24 110.46,47.24 109.76,46.55 IC21.4 | v126.33,46.8 126.71,46.42 132.94,46.42 v134.4,47.88 | v134.4,50.48 134.78,50.86 139.86,50.86 v140.56,50.16
  Bottom 0.254: v121.57,47.24 125.89,47.24 v126.33,46.8 | MCU.17 141.05,51.93 140.56,51.44 v140.56,50.16 | v134.4,47.88 v134.4,50.48
!IO_EXPANDER2  (via drill 0.6)
  Top 0.254: IC23.4 21.05,68.58 24.48,72.01 107.15,72.01 108.55,70.61 110.39,70.61 114.01,66.99 v114.58,66.99
  Bottom 0.254: MCU.46 123.27,38.43 122.01,39.69 120.36,39.69 117.69,42.35 117.69,63.63 116.55,64.77 116.55,66.36 115.92,66.99 v114.58,66.99
!MR  (via drill 0.6)
  Top 0.254: 183.99,27.24 IC32.1 183.85,26.47 183.8,26.42 | 183.8,26.42 177.51,26.42 176.83,25.73 JP8.1 | 183.8,26.42 192.44,26.42 193.01,26.99 v198.09,26.99
  Bottom 0.254: v198.09,26.99 200.37,26.99 202.66,29.27 C152.2 202.66,31.18 204.28,32.8 SW2.4 SW2.3
!PWD_RST  (via drill 0.6)
  Top 0.254: JP3.1 116.43,71.63 117.31,72.5 131.73,72.5 132.24,72.01 v132.24,70.17
  Bottom 0.254: MCU.A13 130.89,24.18 133.44,26.73 133.44,37.97 134.08,38.61 134.08,39.37 133.44,40.01 133.44,68.96 v132.24,70.17
!RESET  (via drill 0.6)
  Top 0.254: v129,17.02 128.68,17.02 IC28.37 | 132.49,33.27 146.97,33.27 149.25,35.56 159.73,35.56 v160.11,35.94 | v132.49,33.66 132.49,33.27 | 132.49,33.27 125.76,33.27 124.55,32.07 v114.71,32.07 114.39,31.75 IC22.3 | v101.76,65.53 101.31,65.53 97.38,69.47 65.24,69.47 64.35,68.58 60.8,68.58 59.97,69.41 39.08,69.41 38.64,68.96 IC25.3 | v160.11,34.1 181.07,34.1 181.96,33.21 v181.96,28.51 IC32.7
  Bottom 0.254: 129.63,17.02 129.63,23.75 132.87,26.99 132.87,33.27 v132.49,33.66 | v129,17.02 129.63,17.02 | 129.63,17.02 130.59,17.02 132.87,14.73 139.48,14.73 X20.6 | v114.71,32.07 114.39,32.38 114.39,39.12 112.17,41.34 112.17,57.34 107.41,62.1 105.19,62.1 v101.76,65.53 | v160.11,34.1 v160.11,35.94 | v181.96,28.51 181.96,25.43 MCU.RESET
!RESET1
  Top 0.254: IC31.1 159.68,30.49 158.4,29.21 158.4,27.9 IC31.6 158.39,26.11 159.73,24.77 173.38,24.77 175.1,26.48 175.1,28.89 175.34,29.13 JP8.3
!RTC_IRQ  (via drill 0.6)
  Top 0.254: IC26.5 158.94,46.58 v159.29,46.93 | v135.92,60.64 136.17,60.9 158.97,60.9 v159.29,60.58
  Bottom 0.254: v159.29,46.93 159.67,47.31 159.67,60.13 v159.29,60.58 | v135.92,60.64 135.92,71.36 MCU.19
+3V3  (via drill 0.6)  (7 unrouted)
  Top 0.254: 124.36,7.68 124.36,7.62 | 131.82,9.93 C136.2 131.07,10.06 130.44,10.69 IC28.28 | IC28.4 119.05,13.19 118.39,13.84 C142.1 | IC28.8 118.91,11.19 | C143.1 118.18,11.19 118.91,11.19 | IC28.11 120.21,9.69 119.85,9.34 119.85,7.75 v119.6,7.49 | 118.91,11.19 v118.97,11.24 | RN2.6 123.51,19.54 123.47,19.49 | RN2.7 RN2.8 121.61,19.54 121.19,19.11 v118.97,19.11 113.38,19.11 112.55,19.94 R148.2 R146.1 | 119.6,7.43 119.28,7.11 C138.1 117.95,7.26 117.95,7.68 117.57,8.06 112.93,8.06 C130.1 | C153.1 204.82,52.83 204.88,52.77 | IC27.8 IC27.7 142.27,46.29 141,45.02 IC27.3 | 108.93,12.13 108.87,12.06 | R169.1 145.95,28.83 v146.08,28.89 | v131.98,28.83 R171.1 | X15.15 30.07,39.5 27.84,37.27 v10.57,37.27 | IC22.7 v111.98,36.83 | R146.1 v108.93,22.98 v108.93,22.99 | R146.1 108.93,21.85 108.93,21.84 | v99.6,30.61 99.22,30.23 79.79,30.23 76.17,33.85 73.94,33.85 73.25,34.54 | IC23.7 17.24,68.96 16.48,69.72 11.97,69.72 v11.78,69.53 | v99.34,60.26 98.2,60.26 R159.1
  Top 0.305: IC28.17 124.38,7.67 124.36,7.68 124.36,6.92 123.54,6.1 123.54,5.84 123.22,5.52 | IC28.15 123.38,6.95 123.09,6.67 121.76,6.67 121.25,6.16 C141.1 | IC28.21 126.38,6.96 125.51,6.1 125.51,5.8 C139.1 | R146.1 | IC23.7 v17.24,66.55 | IC34.8 102.34,61.52 | IC31.8 159.68,28.08 159.73,28.13
  Top 0.406: v26.32,66.42 C117.1 26.36,68.26 24.79,68.26 24.86,68.2 IC23.1 | v148.18,8.7 151.6,8.7 | C136.2 131.69,9.74 v132.62,9.72 | Q28.2 200.19,26.79 R154.2 | R147.2 199.42,50.8 199.67,51.05 | IC32.2 186.05,28.51 | 186.05,28.51 C151.2 186.4,28.61 | 170.08,16.51 184.18,16.51 v184.5,16.19 | 186.05,28.51 186.05,27.58 v185.89,27.43 | 108.93,21.84 108.87,21.78 108.87,21.84 | IC27.8 145.18,49.01 C126.1 144.94,49.4 145,49.34 v146.08,49.34 | v146.08,42.61 146.14,42.67 160.43,42.67 160.75,42.99 168.24,42.99 168.24,42.93 v168.43,42.74 | v168.11,46.86 166.72,46.86 165.95,47.62 165.46,47.62 D27.A | C115.1 110.93,28.17 109.88,29.21 109.44,29.21 | C114.1 108.77,42.08 108.11,42.74 IC21.1 | v42.89,66.42 42.89,67.73 C122.1 42.68,68.2 41.18,68.2 IC25.1 | C150.1 92.74,67.56 v92.8,67.5 92.76,67.46 IC33.5 | v99.34,60.26 99.45,60.16 C156.1 102.04,61.52 102.34,61.52 | v56.67,59.12 56.67,61.27 C107.1 56.74,62.04 | IC20.24 59.13,62.79 58.77,62.42 57.12,62.42 56.67,61.98 | v108.93,22.99 108.81,23.11 101.25,23.11 X18.8 | 159.73,28.13 161.17,28.13 C149.2 162.06,28.28 v162.08,28.26
  Top 0.508: C114.1 v109.76,41.02 | C115.1 v111.98,27.62
  Top 0.61: C139.1 C140.1 C141.1 119.49,5.49 C144.+ | Q28.2 199.24,24.84 v199.23,24.83 | JP4.3 198.85,51.88 199.67,51.05 204.82,51.05 204.88,50.99 | v42.89,66.42 42.89,66.36 43.46,66.36 52.1,57.72 53.05,57.72 55.72,55.05 v56.67,55.05
  Top 0.813: 118.39,13.84 118.9,13.84 v118.97,13.78 | v119.6,7.49 119.6,7.43 119.6,5.59 119.49,5.49
  Top 1.016: v182.02,10.99 171.23,10.99 171.1,11.11 171.1,11.18 | v204.88,24.83 v204.88,17.02 204.88,50.99 204.88,52.77 204.88,54.55 WIFI.2 | v109.76,56.33 v99.34,56.33 v91.85,56.33 69.31,56.33 66.58,53.59 63.4,53.59 61.94,55.05 v56.67,55.05
  Top 1.422: 152.62,18.92 149.57,18.92 146.08,22.42 v146.08,25.46 v130.08,25.46 v118.97,25.46 v111.98,25.46
  Bottom 0.254: v10.57,37.27 10.51,37.34 10.51,52.13 11.46,53.09 11.46,69.22 v11.78,69.53 | v99.6,30.61 99.85,30.35 99.85,24.77 X18.8 | v131.98,28.83 131.98,27.37 v130.08,25.46
  Bottom 0.406: v184.5,16.19 186.02,17.72 186.02,27.3 v185.89,27.43 | v168.11,46.86 168.11,43.05 v168.43,42.74 | v148.18,8.7 148.18,4.57 X19.1 | 157.95,8.64 X17.1 | v91.85,56.33 91.85,66.55 v92.8,67.5 | v99.34,56.33 v99.34,60.26 | v56.67,55.05 v56.67,59.12 | v26.32,66.42 17.36,66.42 v17.24,66.55 | 162.65,19.11 162.65,27.69 v162.08,28.26
  Bottom 0.508: v42.89,66.42 42.89,66.48
  Bottom 0.61: v199.23,24.83 v204.88,24.83 | 42.89,66.48 42.51,66.42 v26.32,66.42
  Bottom 0.813: v132.62,9.72 130.4,7.49 v119.6,7.49 118.97,8.13 v118.97,11.24 v118.97,13.78 v118.97,19.11 v118.97,25.46
  Bottom 1.016: v182.02,10.99 197.58,10.99 198.34,11.75 198.34,15.49 199.86,17.02 v204.88,17.02 | v146.08,49.34 v146.08,42.61 v146.08,28.89 v146.08,25.46
  Bottom 1.27: v111.98,25.46 v111.98,27.62 v111.98,36.83 111.98,38.04 111.47,38.54 109.76,40.32 v109.76,41.02 v109.76,56.33
  other vias: 163.48,18.1 163.48,17.08 163.48,16.07 163.48,15.05 163.48,14.03 163.48,13.02 170.15,16.07 170.15,17.08 170.15,18.1 170.15,15.05 170.15,14.03 170.15,13.02
  pour Top (isolate 0.305, no thermals): 151.48,19.49 171.73,19.49 171.73,8.38 151.48,8.38
  pour Bottom (isolate 0.305, no thermals): 151.48,19.49 171.73,19.49 171.73,8.38 151.48,8.38
+5V  (via drill 0.6)  (4 unrouted)
  Top 0.254: 189.07,16.45 189.07,16.57 v189.26,16.76 | D26.C 197.52,4.19 197.64,4.32
  Top 0.406: Q25.2 52.98,16.02 R135.2 | R134.2 96.42,14.84 Q23.2 | v22.19,52.2 v14.7,52.2 | Q26.2 R139.2 | Q24.2 50.82,56.31 | 51.15,56.64 R137.2 | v71.53,64.64 71.53,65.75 FB7.P$1 | v14.7,64.77 14.06,65.41 11.02,65.41 10.32,66.1 | C119.1 186.02,17.71 186.15,17.84
  Top 0.508: v51.46,15.94 52.44,15.94 R135.2 | v73.05,17.14 72.86,16.95 72.86,17.27 70.39,19.75 68.04,19.75 66.64,21.14 v63.4,21.14
  Top 0.61: 198.78,60.64 198.85,60.71 198.85,62.17 197.32,63.69 179.35,63.69 v179.16,63.88 180.24,64.96 180.24,65.22 | C125.2 180.37,65.66 180.24,65.22 | 180.24,65.22 177.1,65.22 SP1.+B | R134.2 v96.42,11.24 96.36,11.18 91.34,11.18 85.56,16.95 73.25,16.95 v73.05,17.14 | v96.42,3.24 96.42,2.29 97.56,1.14 145.63,1.14 145.83,1.33 | v14.7,64.77 43.78,64.77 50.96,57.59 R137.2
  Top 1.016: v111.22,54.99 v97.31,54.99 v90.45,54.99 v71.53,54.99 69.88,54.99 67.15,52.26 62.83,52.26 61.37,53.72 55.4,53.72 52.61,56.52 51.21,56.52 51.15,56.58 | v113.44,23.05 120.24,23.05 122.27,21.02 145.32,21.02 v145.76,20.57 | v145.76,2.48 145.76,1.46 145.83,1.33 188.56,1.33 190.97,3.75 190.97,4.32
  Top 1.422: MCU.5V 179.15,17.91 179.23,17.84 | IC24.3 179.23,17.84 | 179.23,17.84 186.15,17.84 187.68,17.84 189.07,16.45 189.07,6.22 190.97,4.32 197.64,4.32 201.32,4.32 SW1.3
  Bottom 0.254: v189.26,16.76 189.32,16.83 198.34,16.83 199.48,17.97 201.13,17.97 203.55,20.39 LED_PWR.A | LED_CC1.A 89.99,54.34 90.01,54.86 90.01,60.74 LED_CV2.A
  Bottom 0.406: 51.46,16.57 51.46,17.71 LED_SP.A | 22.2,52.19 v22.19,52.2 22.45,51.94 LED_PROG2.A | v14.7,64.77 14.7,60.96 LED_CV1.A LED_CC2.A 14.7,53.95 v14.7,52.2 14.7,47.25 LED_S2.A | LED_CC1.A LED_S1.A | v97.31,54.99 97.31,46.96 LED_PROG1.A | LED_O1.A 72.8,16.96 v73.05,17.14 | v71.53,64.64 v71.53,54.99 | 145.7,6.6 142.52,6.6 X20.2
  Bottom 0.508: LED_O2.A 32.7,17.56 32.67,17.53 33.62,16.57 51.46,16.57 v51.46,15.94 58.2,15.94 v63.4,21.14
  Bottom 0.61: 145.7,6.6 145.76,6.67 | v90.45,54.99 90.02,54.17 LED_CC1.A | v96.42,11.24 v96.42,3.24
  Bottom 1.016: v113.44,23.05 113.38,23.05 113.38,38.8 111.22,40.96 v111.22,54.99 | v145.76,20.57 145.76,6.67 v145.76,2.48 | MCU.5V 179.15,23.29 179.16,23.3 v179.16,63.88
AUX1_USET_IN  (1 unrouted)
  Top 0.254: X12.8.1 95.91,37.21 76.67,37.21 74.28,39.61 X13.11
  Top 0.406: X12.8 97.78,32.58 ZD10.C
AUX2_USET_IN  (2 unrouted)
  Top 0.406: X14.6 24.7,31.75 ZD11.C | X15.11 25.09,34.39 24.73,34.04
BATT_NTC  (via drill 0.6)
  Top 0.254: v156.3,33.85 156.3,33.97 155.86,34.42 150.27,34.42 v149.7,33.85 | v149.63,63.69 149.25,63.31 128.05,63.31 127.66,63.69 125.31,63.69 v124.93,64.07 | OK3.4 95.91,60.45 R159.2 95.98,61.28 96.49,61.78 100.93,61.78 101.76,62.61 104.74,62.61 107.34,60.01 v119.28,60.01
  Bottom 0.254: v149.63,63.69 149.25,63.31 149.25,34.29 v149.7,33.85 | MCU.A4 156.29,33.83 v156.3,33.85 | v124.93,64.07 123.98,65.02 120.17,65.02 118.84,63.69 118.84,60.39 119.22,60.01 v119.28,60.01
BP_SELECT  (via drill 0.6)
  Top 0.254: IC20.4 61.07,59.38 61.37,59.69 63.78,59.69 64.23,60.13 86.07,60.13 87.02,61.15 94.26,61.15 95.41,62.29 100.68,62.29 101.5,63.12 105,63.12 106.58,61.53 114.52,61.53 115.47,62.48 v119.73,62.48 | v178.15,68.07 177.77,68.45 172.88,68.45 171.92,67.5 171.16,67.5 169.7,68.96 140.11,68.96 139.79,69.28 128.55,69.28 v128.24,69.6
  Bottom 0.254: MCU.9 178.14,68.21 v178.15,68.07 | v119.73,62.48 126.2,62.48 128.24,64.52 v128.24,69.6
BUZZER  (via drill 0.6)
  Top 0.254: Q27.1 184.31,60.2 R143.2 184.88,61.66 v185,61.78
  Bottom 0.254: MCU.12 185.76,62.54 v185,61.78
CH1_GND  (via drill 0.6)
  other vias: 105.57,38.1 102.14,52.7 83.91,47.88 83.53,50.48 95.6,48.45 96.3,41.34 103.47,39.75 101.25,28.89 100.11,37.4 99.47,52.26 69.5,51.05 76.99,51.05 85.37,41.34 76.42,30.54
  pour Bottom (isolate 0.305, rank 4): 68.93,53.85 104.49,53.85 104.49,39.81 106.07,39.81 106.07,26.48 98.45,26.48 98.45,28.96 68.93,28.96
  pour Top (isolate 0.305, rank 4): 68.93,53.85 104.49,53.85 104.49,39.81 106.07,39.81 106.07,26.48 98.45,26.48 98.45,28.96 68.93,28.96
CH1_MISO  (via drill 0.6)  (2 unrouted)
  Top 0.254: 102.05,48.96 IC21.11 | 102.01,48.96 101.44,48.96 99.41,46.93 79.02,46.93 78.26,47.69 77.56,47.69 v76.42,48.83
  Bottom 0.254: 73.25,42.16 75.47,44.39 75.47,47.88 v76.42,48.83
CH1_MOSI  (via drill 0.6)
  Top 0.254: IC21.14 101.5,45.28 101.44,45.21 77.75,45.21 v77.37,45.59
  Bottom 0.254: v77.37,45.59 77.37,49.21 74.28,52.31 X13.1
CH1_SCLK
  Top 0.254: IC22.12 103.22,34.29 101.31,36.2 101.31,38.1 96.49,42.93 76.04,42.93 74.28,44.69 X13.7
CH1_SYNC
  Top 0.254: IC22.15 100.8,30.48 99.98,29.65 79.53,29.65 75.91,33.27 71.97,33.27 X13.16
CH1_VDD  (via drill 0.6)  (1 unrouted)
  Top 0.254: IC30.8 | IC21.10 v100.93,50.35 | v102.84,36.83 IC22.10 | IC29.1 79.09,50.49 v79.09,51.12 79.09,53.53 78.96,53.66 | IC30.4 91.41,51.88 | IC29.4 80.92,48.69 v80.74,48.51
  Top 0.406: IC21.16 101.8,42.74 C113.1 101.8,41.31 101.82,41.34 101.76,41.4 v100.93,41.4 100.93,41.02 102.52,39.43 102.52,37.15 v102.84,36.83 | 103.7,29.21 IC22.16 103.92,29.05 v103.92,27.62 C116.1 | v91.47,48.07 IC30.8 86.92,48.07 C147.1 | v91.47,51.88 91.47,53.72 74.51,53.66
  Top 0.61: v100.61,53.4 100.36,53.66 78.96,53.66 74.51,53.66 72.06,53.66 X13.2
  Bottom 0.254: v80.74,48.51 80.74,49.47 v79.09,51.12
  Bottom 0.406: v91.47,48.07 v91.47,51.88 | v103.92,27.62 103.92,35.75 v102.84,36.83
  Bottom 0.61: v100.93,41.4 v100.93,50.35 100.61,50.67 v100.61,53.4
CH2_GND  (via drill 0.6)
  other vias: 10.51,62.36 32.22,60.52 20.79,46.8 25.81,25.78 33.49,53.91 26.45,63.06 38.13,53.91 28.86,53.91 25.49,56.45 10.51,56.45 25.81,22.03 25.81,32.96 19.27,31.24 5.62,51.12 5.62,40.45 18.7,56.45
  pour Top (isolate 0.305, rank 2): 0.35,63.63 43.84,63.63 43.84,53.09 36.54,53.09 36.54,21.08 0.35,21.08
  pour Bottom (isolate 0.305, rank 4): 0.35,63.63 43.84,63.63 43.84,53.09 28.92,53.09 27.65,51.88 26.19,50.42 26.19,21.08 0.35,21.08
CH2_MISO  (via drill 0.6)
  Top 0.254: X15.9 32.25,31.71 29.62,29.08 17.24,29.08 15.9,30.42 14.19,30.42 13.81,30.8 12.03,30.8 v11.78,31.05 | v9.17,56.13 9.87,55.44 26.57,55.44 30.64,59.5 33.94,59.5 34.83,60.39 IC25.11
  Bottom 0.254: v11.78,31.05 9.17,31.05 4.67,35.56 4.67,53.66 7.14,56.13 v9.17,56.13
CH2_MOSI  (via drill 0.6)
  Top 0.254: X15.1 32.16,21.72 30.19,23.69 11.21,23.69 4.6,30.29 v4.6,33.72 | v8.28,57.09 8.67,57.47 19.65,57.47 22.32,60.13 IC23.14
  Bottom 0.254: v4.6,33.72 4.6,34.1 4.09,34.61 4.09,53.91 7.2,57.02 8.22,57.02 v8.28,57.09
CH2_SCLK  (via drill 0.6)
  Top 0.254: X15.7 30.89,27.94 16.16,27.94 v15.78,28.32 | v2.57,57.47 2.57,57.4 5.11,54.86 26.83,54.86 30.89,58.93 34.38,58.93 36.1,60.64 IC25.12
  Bottom 0.254: v15.78,28.32 15.4,27.94 5.3,27.94 1.24,32 1.24,56.2 2.51,57.47 v2.57,57.47
CH2_SYNC  (via drill 0.6)
  Top 0.254: X15.16 34.79,39.53 33.56,40.77 23.91,40.77 v23.52,41.15 | IC23.15 23.59,57.34 v23.52,57.28
  Bottom 0.254: v23.52,41.15 23.52,47.82 23.97,48.26 23.97,56.83 v23.52,57.28
CH2_VDD  (via drill 0.6)
  Top 0.254: IC25.10 v33.56,60.45 | X15.2 34.79,21.75 | 24.86,62.48 IC23.16 24.86,63.25 24.48,63.63 17.56,63.63 17.24,63.31 IC23.10
  Top 0.406: 24.9,60.94 24.86,60.9 | 24.86,60.9 IC23.16 | 41.18,62.74 IC25.16 41.18,61.78 41.3,61.78 42.47,60.62 C121.1 | 34.79,21.75 35.31,21.75 36.29,22.73 36.29,37.72 36.92,38.35 v36.92,55.24 | 26.48,60.07 C118.1 | C118.1 25.64,60.11 24.86,60.9 | 42.6,60.45 C121.1 | v42.57,59.44 42.57,60.43 C121.1 | C118.1 26.72,60.11 v27.27,59.56
  Bottom 0.254: v33.56,60.45 33.56,59.44
  Bottom 0.406: v36.92,55.24 36.92,59.44 | 36.92,59.44 v42.57,59.44 | 36.92,59.44 33.56,59.44 27.4,59.44 v27.27,59.56
EARTH  (via drill 0.6)  (2 unrouted)
  Top 0.305: C133.2 C130.2
  Top 0.406: 74.71,1.46 74.77,1.4 | 54.7,1.4 54.96,1.65 C108.1 | 35.59,1.4 35.65,1.46 C110.2 | C130.2 103.22,12.06 101.88,10.73 X18.3 98.58,10.73 97.38,9.53 v89.06,9.53 | C112.1 16.41,1.4 | C105.2 73.12,1.4
  Top 1.016: v89.06,9.53 89.06,5.02 85.44,1.4 74.77,1.4 73.12,1.4 54.7,1.4 35.59,1.4 16.41,1.4 14.7,1.4 8.5,7.59 J2.P$1
  Bottom 0.406: X12.3 84.8,33.92 84.8,28.45 89.06,24.19 v89.06,9.53 | X14.1 11.75,33.55 13.17,32.13 16.41,32.13 17.49,31.11 17.49,17.99 J2.P$1
ENC_A  (via drill 0.6)
  Top 0.254: 142.69,28.93 R170.1 | C154.2 R170.1 | R170.1 142.4,28.57 v142.4,27.69
  Bottom 0.254: v142.4,27.69 142.4,25.08 143.54,23.94 143.54,23.2 MCU.A8
ENC_B  (via drill 0.6)
  Top 0.254: 135.67,28.83 R172.1 136.2,28.93 137.85,28.93 C155.1 v137.95,27.75
  Bottom 0.254: v137.95,27.75 137.95,26.25 MCU.A9
ETH_ACTLED  (via drill 0.6)
  Top 0.254: IC28.27 130.18,10.19 130.33,10.03 130.33,7.68 131.16,6.86 131.16,6.48 v131.6,6.03 | R155.1 v113.5,6.22
  Bottom 0.254: v131.6,6.03 131.54,6.03 131.16,5.65 130.52,5.65 129.7,4.83 114.9,4.83 v113.5,6.22
ETH_IN+  (via drill 0.6)
  Top 0.254: v106.07,15.94 106.97,15.94 R150.1 | C134.1 111.45,14.19 v111.41,14.22
  Top 0.406: v106.07,15.94 104.55,15.94 101.88,13.27 X18.4
  Bottom 0.406: v106.07,15.94 109.69,15.94 v111.41,14.22
ETH_IN-  (via drill 0.6)
  Top 0.254: v111.34,17.21 111.34,16.3 C132.1
  Top 0.406: X18.5 101.88,15.81 104.04,17.97 v106.07,17.97 R149.2
  Bottom 0.406: v106.07,17.97 110.58,17.97 v111.34,17.21
ETH_LINKLED  (via drill 0.6)
  Top 0.254: IC28.25 129.4,7.79 130.59,6.6 130.59,5.02 v130.9,4.7 | v114.52,3.05 R156.1
  Bottom 0.254: v130.9,4.7 130.46,4.25 115.73,4.25 v114.52,3.05
ETH_OUT+  (via drill 0.6)
  Top 0.254: IC28.2 119.89,14.19 119.22,14.86 117.12,14.86 v116.43,15.56
  Top 0.406: X18.6 101.88,18.35 103.41,19.88 v106.07,19.88 106.97,19.88 R148.1
  Bottom 0.406: v116.43,15.56 112.11,19.88 v106.07,19.88
ETH_OUT-  (via drill 0.6)
  Top 0.254: R146.2 | IC28.1 120.22,14.69 119.47,15.43 117.69,15.43 117.38,15.75 117.38,16.51 v117.19,16.7 | 106.97,21.97 v106.07,21.97
  Top 0.406: 106.97,21.97 R146.2 | X18.7 101.69,20.89 102.77,21.97 v106.07,21.97
  Bottom 0.406: v117.19,16.7 116.3,16.7 111.03,21.97 v106.07,21.97
EXT_TRIG  (via drill 0.6)
  Top 0.254: v149.06,68.01 148.68,68.39 139.86,68.39 139.54,68.71 125.06,68.71 123.66,70.1 120.43,70.1 117.89,67.56 v116.74,67.56 | v96.93,67.88 96.93,65.34 R168.1
  Bottom 0.254: MCU.A7 149.38,23.86 149.38,30.42 148.67,31.13 148.67,67.64 148.69,67.64 v149.06,68.01 | v116.74,67.56 116.36,67.94 111.79,67.94 109.88,69.85 98.9,69.85 v96.93,67.88
FAN_PWM
  Bottom 0.254: MCU.6 169,71.4 169,68.26 171.16,66.1 173,66.1 174.02,65.09 174.02,63.18 178.21,58.99 178.21,23.81 177.89,23.5 177.89,11.18 176.5,9.78 176.5,7.18 X16.6
FAN_SENSE  (via drill 0.6)
  Top 0.254: v180.5,62.61 180.94,62.99 188.43,62.99 v188.81,62.61
  Bottom 0.254: X16.5 177,5.14 177,9.53 178.46,10.99 178.46,20.57 180.43,22.54 180.43,23.5 180.12,23.81 180.12,62.17 v180.5,62.61 | MCU.13 188.3,63.13 v188.81,62.61
GND  (via drill 0.6)  (3 unrouted)
  Top 0.254: IC28.29 128.41,11.19 128.3,11.3 | 129.38,11.18 131.73,11.18
  Top 0.305: 128.7,11.19 IC28.29
  Top 0.406: v52.23,21.27 52.23,19.99 D23.A | 12.28,51.74 D25.A 12.02,52.01 v12.79,52.01 13.11,51.69 13.11,49.66 K_S2.8 | D24.A 42.75,44.31 39.15,40.7 K_PAR.A1 | v46.7,53.47 46.57,53.47 43.59,50.48 42.76,50.48 | D22.A 89.58,19.42 89.56,19.43 K_S1.8 | v90.45,19.37 89.06,19.37 88.99,19.43 | v86.58,31.94 82.06,31.94 X12.1
  Top 0.813: v51.15,3.11 51.15,13.97 50,15.11 50,17.77 D23.A
  Bottom 0.406: K_SER.A1 63.63,31.34 53.56,21.27 v52.23,21.27 | v12.79,52.01 12.79,65.66 | 99.6,14.29 92.17,14.29 90.45,16 v90.45,19.37 90.45,24.38 86.58,28.26 v86.58,31.94
  Bottom 0.61: 122.9,9.02 SH3.P$1 | 99.6,14.29 99.66,14.35
  Bottom 0.813: 100.04,1.27 52.99,1.27 v51.15,3.11
  other vias: 115.22,14.67 132.43,7.05 115.22,11.18 128.24,11.18 116.23,3.05 202.28,2.22 58.13,58.42 53.69,64.52 44.73,66.61 14.83,67.75 106.01,57.66 73.25,66.55 105.95,51.63 107.85,38.1 117.82,38.61 119.22,51.12 130.97,3.37 115.47,7.11 122.71,23.37 107.92,27.62 205.64,69.28 186.02,14.48 149,15.68 184.37,4.06 165.32,21.02 149,13.4 174.53,14.92 176.81,13.27 171.1,33.15 158.65,39.75 139.48,30.73 121.5,17.72 92.93,59.18 117.82,33.02 119.22,48.26 130.59,19.43 124.17,2.73 115.22,41.08 119.22,46.04 115.6,58.99 173.07,37.85 144.05,35.69 136.17,43.37 124.81,33.66 136.17,39.81 136.17,35.05 137.25,48.51 142.97,50.74 132.17,50.48 132.17,56.45 173.07,42.16 159.29,45.02 139.54,35.12 139.73,59.94 126.84,56.45 126.33,43.75 126.84,69.6 184.81,65.79 139.73,65.85 126.84,65.85 173.07,44.83 155.03,67.44 155.03,64.9 163.86,64.9 170.08,65.53 155.03,59.94 157.7,30.1 183.61,32.13 182.15,52.83 182.53,61.21 174.59,66.04 181.51,44.83 137.89,5.02 137.89,17.53 115.22,21.27 180.94,19.56 183.8,25.53 197.45,9.65 185.96,9.72 6.25,65.34 97.18,58.61 29.24,67.82 110.77,65.34 101.57,68.58 115.6,60.9 108.93,58.99 118.9,66.36 121.63,67.56 114.9,63.44 102.2,3.24 105,10.16 126.33,39.69 132.17,65.85 146.65,59.94 46.45,68.07 31.21,68.71 119.22,54.86 126.84,59.94 105.82,41.15 155.16,21.08 166.78,59.94 161.7,49.72 205.26,56.71 102.26,24.89 99.53,14.54 20.98,72.52 160.05,26.48 197.45,42.23 188.24,61.21 177.38,62.42
  pour Bottom (isolate 0.254, rank 2): 0.35,74.1 207.42,74.1 207.08,0.11 98.01,0.11 98.01,25.46 107.03,25.46 107.03,40.77 105.44,40.77 105.44,54.61 68.67,54.67 67.09,53.09 44.8,53.09 44.8,64.58 0.35,64.58
  pour Top (isolate 0.254, rank 2): 0.35,74.1 207.42,74.1 207.42,0.06 98.77,0.06 98.77,25.46 107.03,25.46 107.03,40.77 105.44,40.77 105.44,54.67 68.67,54.67 67.09,53.09 44.8,53.09 44.8,64.58 0.35,64.58
GNDA  (via drill 0.6)  (1 unrouted)
  Top 0.254: IC28.48 122.1,16.21 121.76,15.88 121.76,13.72 121.73,13.69 | IC28.3 121.73,13.69 | R152.1 116.24,9.34 117.25,10.35 119.41,10.35 119.75,10.69 IC28.9 121.74,10.69 121.76,10.67 | v122.14,12.26 121.76,12.26 | 122.89,7.4 122.88,7.42 IC28.14 122.88,8.61 122.9,8.64 | 125.37,7.67 125.37,8.46 125.19,8.64 123.85,8.64 | 123.85,8.64 122.9,8.64 | 122.9,8.64 122.27,8.64 121.76,9.14 121.76,10.67 | IC28.16 123.88,8.62 123.85,8.64 | 121.76,10.67 121.76,12.26 | 121.76,12.26 121.76,13.66 121.73,13.69
  Top 0.305: 125.37,7.4 125.37,7.67 125.38,7.68 IC28.19
  Bottom 0.254: 122.9,10.98 122.9,11.5 | v122.14,12.26 122.14,11.68 122.33,11.49 122.9,11.49 | C145.- 122.58,10.79 SH3.P$2
  Bottom 0.61: 122.9,10.98 122.2,10.53 SH3.P$2
  pour Top (isolate 0.305, no thermals): 122.39,16.51 122.39,8.7 125.38,8.7 125.38,7.37 121.31,7.37 120.81,7.87 120.81,15.37 121.95,16.51
ISOLATOR1_EN  (via drill 0.6)  (2 unrouted)
  Top 0.254: v121.63,52.32 116.87,52.32 116.3,51.75 109.82,51.75 108.42,50.35 107.53,50.35 | v147.73,51.63 147.35,52.01 126.33,52.01 v125.57,51.24
  Bottom 0.254: 148.68,71.44 148.11,70.87 148.11,52.01 v147.73,51.63 | v121.63,52.32 123.66,52.32 124.74,51.24 v125.57,51.24
ISOLATOR2_EN  (via drill 0.6)
  Top 0.254: v117.5,65.09 115.16,65.09 110.2,70.04 106.46,70.04 105.5,70.99 64.48,70.99 63.59,70.1 61.56,70.1 60.74,70.93 36.03,70.93 33.56,68.45 IC25.7
  Bottom 0.254: MCU.45 119.94,40.93 118.27,42.61 118.27,64.33 v117.5,65.09
LCD_BRIGHTNESS  (via drill 0.6)  (1 unrouted)
  Top 0.254: R153.1 v198.4,29.59 | v197.64,68.26 196.88,69.03 172.12,69.03 v171.54,68.45
  Bottom 0.254: v198.4,29.59 198.4,68.26 v197.64,68.26 | v171.54,68.45 171.54,71.37
LCD_CS  (via drill 0.6)
  Top 0.254: v186.91,37.66 186.85,37.59 181.32,37.59 180.62,36.89 162.97,36.89 161.26,38.61 133.51,38.61 v133.12,38.99 | MCU.39 121.66,48.55 122.84,47.37 125.51,47.37 125.95,47.82 126.65,47.82 127.47,46.99 131.79,46.99 v132.49,47.69
  Bottom 0.254: v186.91,37.66 186.91,37.27 188.5,35.69 188.5,31.18 192.12,27.56 192.12,25.65 193.45,24.32 194.91,24.32 196.29,25.7 LCD1.15 | v133.12,38.99 132.87,39.24 132.87,47.31 v132.49,47.69
LCD_DB0  (via drill 0.6)